# Altium schematic sheet Voeding.SchDoc
size A4; SheetNumber: 3; SheetTotal: 5
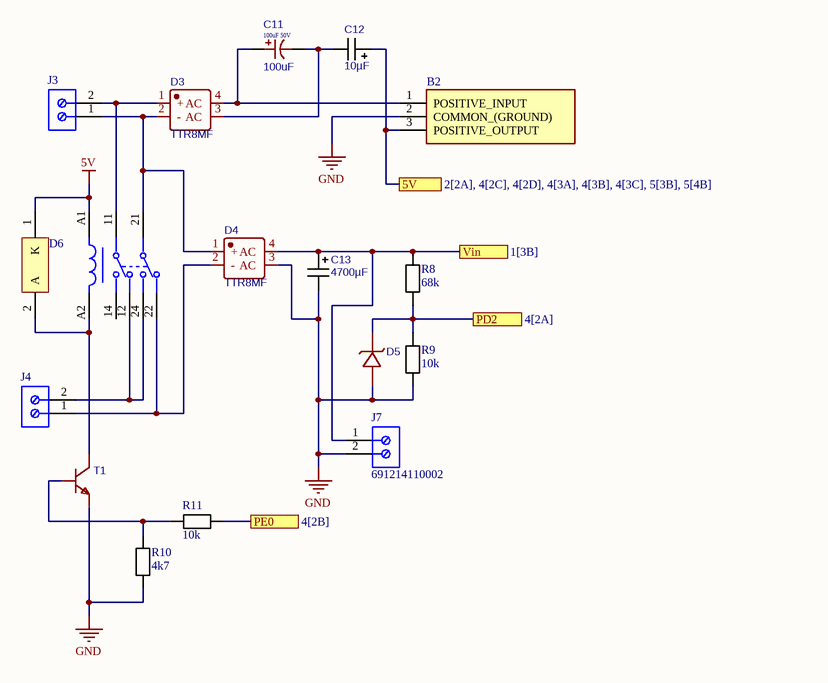
[diagram p0: Voeding.SchDoc]

## Parts
B2  OKI-78SR-5_1.5-W36-C  [OKI78SR515W36C]  (value not drawn)
C11  100uF  [100uF 50V]
C12  10µF  [10uf]
C13  4700µF  [4700uf]
D3  TTR8MF  [TTR8MF]
D4  TTR8MF  [TTR8MF]
D5  BZT52C5V1_C353516  [BZT52C5V1_C353516]  (value not drawn)
D6  1N4007  [1N4007 THT]  (value not drawn)
J3  691214110002  [2 Screw Terminal WE 691214110002]  (value not drawn)
J4  691214110002  [2 Screw Terminal WE 691214110002]  (value not drawn)
J7  691214110002  [2 Screw Terminal WE 691214110002]
Projects_Projects_Projects_Projects  RT424005  [RT424005-MFG Power Relay]  (value not drawn)
R8  68k  [R0805]
R9  10k  [R0805]
R10  4k7  [R0805]
R11  10k  [R0805]
T1  BC547  [BC847C_NPN]  (value not drawn)

## Ports
5V (see 2[2A], 4[2C], 4[2D], 4[3A], 4[3B], 4[3C], 5[3B], 5[4B]), PD2 (see 4[2A]), PE0 (see 4[2B]), Vin (see 1[3B])

## Nets
5V: D6.1(K) Projects_Projects_Projects_Projects.A1
GND: B2.2(COMMON_(GROUND)) C13.2 D4.3(AC) D5.2(A) J7.2 R9.2 R10.2 T1.2(E)
5V: B2.3(POSITIVE_OUTPUT) C12.1 ; port 5V  [a separate net that carries the same name]
PD2: D5.1(K) R8.1 R9.1 ; port PD2
PE0: R11.1 ; port PE0
Vin: C13.1 D4.4(AC) J7.1 R8.2 ; port Vin
NetB2_1: B2.1(POSITIVE_INPUT) C11.1 D3.4(AC)
NetC11_2: C11.2 C12.2 D3.3(AC)
NetD3_1: D3.1(+) J3.2 Projects_Projects_Projects_Projects.11
NetD3_2: D3.2(-) D4.1(+) J3.1 Projects_Projects_Projects_Projects.21
NetD4_2: D4.2(-) J4.1 Projects_Projects_Projects_Projects.22
NetD6_2: D6.2(A) Projects_Projects_Projects_Projects.A2 T1.3(C)
NetJ4_2: J4.2 Projects_Projects_Projects_Projects.12 Projects_Projects_Projects_Projects.24
NetR10_1: R10.1 R11.2 T1.1(B)

Not connected (* = marked no-connect by the designer): Projects_Projects_Projects_Projects 14

## Notes on the sheet
- (in symbol 100uF_50V) 100uF 50V

## Library data of the parts
B2 = OKI-78SR-5_1.5-W36-C: Non-Isolated DC/DC Converters 7.5W 24Vin 5Vout1 1.5A SIP Non-Iso; Manufacturer_Name: Murata Electronics; Manufacturer_Part_Number: OKI-78SR-5/1.5-W36-C; Geometry.Height: 16.5mm; Mouser Part Number: 580-OKI78SR5/1.5W36C; Mouser Price/Stock: https://www.mouser.co.uk/ProductDetail/Murata-Power-Solutions/OKI-78SR-5-1.5-W36-C?qs=uJpRT2lXVNXJP%252Bo08dQqJQ%3D%3D; Datasheet Link: https://www.murata.com/products/productdata/8807037992990/oki-78sr.pdf?1583754815000
C11 = 100uF_50V: BOM_Manufacturer: Nichicon(尼吉康); BOM_Manufacturer Part: UWT1H101MNL1GS; Contributor: LCSC; nameAlias: Capacitance; BOM_Supplier: LCSC; BOM_Supplier Part: C445063; BOM_JLCPCB Part Class: Extended Part; spicePre: C; spiceSymbolName: UWT1H101MNL1GS
C12 C13 = 10uF: BOM_Manufacturer: ST(先科); BOM_Manufacturer Part: CS1E100M-CRC54; nameAlias: Capacitance; Contributor: LCSC; BOM_Supplier: LCSC; BOM_Supplier Part: C98750; BOM_JLCPCB Part Class: Extended Part; spicePre: C; spiceSymbolName: CS1E100M-CRC54
D3 D4 = TTR8MF: BOM_Manufacturer: MDD; Contributor: LCSC; BOM_Supplier: LCSC; BOM_Supplier Part: C712546; BOM_Manufacturer Part: TTR8MF; BOM_JLCPCB Part Class: Extended Part; spicePre: D; spiceSymbolName: TTR8MF
D5 = BZT52C5V1_C353516: BOM_Manufacturer: 晶导微电子; Contributor: LCSC; BOM_Supplier: LCSC; BOM_Supplier Part: C353516; BOM_Manufacturer Part: BZT52C5V1; BOM_JLCPCB Part Class: Extended Part; spicePre: D; spiceSymbolName: BZT52C5V1_C353516
D6 = 1N4007 THT: Standard Recovery Rectifier, 2-Pin Axial_Lead, Pb-Free, Bulk Bag; Manufacturer: On Semiconductor; IO(rec) Max (A): 1; IFSM Max (A): 30; VRRM Max (V): 1000; ComponentLink3URL: http://www.onsemi.cn/pub_link/Collateral/59-10.PDF; PackageVersion: Rev. U, 02/2005; PackageDescription: 2-Pin, Axial Lead, Diameter 2.35 mm; PackageReference: AXIAL_LEAD-2-59-10; RoHS: TRUE; PartNumber: 1N4007; Packing: Bulk Bag; DatasheetVersion: Rev. 13; ComponentLink3Description: Package Specification; ComponentLink1Description: Manufacturer URL; ComponentLink2URL: http://www.onsemi.com/pub_link/Collateral/1N4001-D.PDF; ComponentLink1URL: http://www.onsemi.com/; Type: Standard Recovery; ComponentLink2Description: Datasheet; Mounting Technology: Through Hole
J3 J4 J7 = 2 Screw Terminal WE 691214110002: Serie 2141 - 3.50 mm Horizontal Entry Modular with Rising Cage Clamp WR-TBL, 2 pin; Manufacturer: Wurth Elektronik; Pin Number: 2; Pitch: 3.50mm; Datasheet URL: http://katalog.we-online.de/em/datasheet/6912141100xx.pdf; Packaging: Box; Mounting Technology: THT; Package Reference: 691214110002; Manufacturer URL: http://www.we-online.de; Part Number: 691214110002; Publisher: WurthElektronik; Operating Temperature: -40to105degC
Projects_Projects_Projects_Projects = CMP-03395-000087-1: RELAY GENERAL PURPOSE DPDT 8A 5V; Manufacturer: TE Connectivity; Coil Power: 403mW; Number Of Contacts: 2; Coil Resistance: 62Ω; Coil Type: Non-Latching; Manufacturer Part Number: RT424005; Category: Relay; Octopart: https://octopart.com/5-1393243-9-te+connectivity-41835766; Device Class L3: Power Relays; ComponentLink2URL: https://www.te.com/commerce/DocumentDelivery/DDEController?Action=showdoc&DocId=Data+Sheet%7FRT2%7F1014%7Fpdf%7FEnglish%7FENG_DS_RT2_1014.pdf%7F5-1393243-9; Ambient Temperature Range High: +85°C; ComponentLink2Description: Datasheet; Throw Configuration: DPDT; Digikey Description: RELAY GENERAL PURPOSE DPDT 8A 5V; Package: RT424005; Automotive: No; Device Class L1: Electromechanical; Height: 15.7mm; Device Class L2: Relays; Ambient Temperature Range Low: -40°C; Coil Voltage: 5V; Current Rating: 8A; Mouser Description: General Purpose Relay, Rt2 Series, Power, Non Latching, Dpdt, 5 Vdc, 8 A Rohs Compliant: Yes; Lead Free: Yes; RoHS: TRUE
R8-R11 = Resistor: Manufacturer: Vishay Dale; Part Number: CRCW08050000Z0EA
T1 = BC847C_NPN: BOM_Manufacturer: SALLTECH(萨瑞); BOM_Manufacturer Part: BC847C; Contributor: lcsc; BOM_Supplier: LCSC; BOM_Supplier Part: C3027113; link: https://atta.szlcsc.com/upload/public/pdf/source/20220824/287706FC7904CA05889B348536529CCD.pdf; BOM_JLCPCB Part Class: Extended Part; spicePre: Q; spiceSymbolName: BC847C_C3027113